# EAGLE design tanklight (EAGLE 6.4)
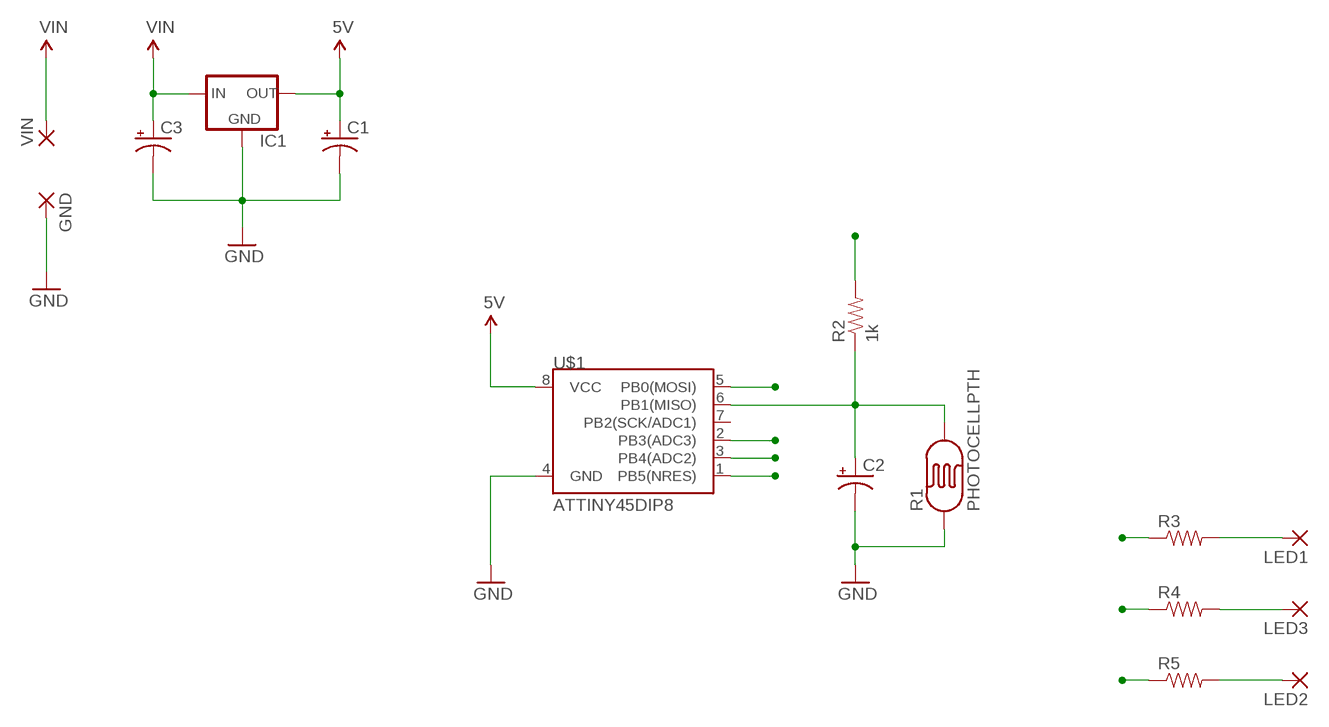
[diagram p0: schematic, sheet 1]

## Parts
C1  CAP_POLPTH2  [CPOL-RADIAL-10UF-25V]
C2  CAP_POLPTH1  [CPOL-RADIAL-100UF-25V]
C3  CAP_POLPTH2  [CPOL-RADIAL-10UF-25V]
GND  2,54/1,0  [2,54/1,0]
IC1  V_REG_78XXSINK  [TO220-IGO]
LED1  2,54/1,0  [2,54/1,0]
LED2  2,54/1,0  [2,54/1,0]
LED3  2,54/1,0  [2,54/1,0]
R1  PHOTOCELLPTH  [PHOTOCELL]
R2  1k  RESISTORPTH-1/4W  [AXIAL-0.4]
R3  RESISTORPTH-1/4W  [AXIAL-0.4]
R4  RESISTORPTH-1/4W  [AXIAL-0.4]
R5  RESISTORPTH-1/4W  [AXIAL-0.4]
U$1  ATTINY45DIP8  [DIP08]
VIN  2,54/1,0  [2,54/1,0]

## Nets
5V: C1.1(+) IC1.OUT R2.P$2 U$1.1(PB5(NRES)) U$1.8(VCC)
GND: C1.2(-) C2.2(-) C3.2(-) GND.1(P) IC1.GND R1.1 U$1.4(GND)
LED1: R3.P$1 U$1.5(PB0(MOSI))
LED2: R5.P$1 U$1.3(PB4(ADC2))
LED3: R4.P$1 U$1.2(PB3(ADC3))
N$1: C2.1(+) R1.2 R2.P$1 U$1.6(PB1(MISO))
N$2: LED1.1(P) R3.P$2
N$3: LED3.1(P) R4.P$2
N$4: LED2.1(P) R5.P$2
VIN: C3.1(+) IC1.IN VIN.1(P)
Unconnected: U$1.7(PB2(SCK/ADC1))

## Library data of the parts
C1-C3 = SparkFun-Passives:CAP_POL: Capacitor Polarized These are standard SMD and PTH capacitors. Normally 10uF, 47uF, and 100uF in electrolytic and tantalum varieties. Always verify the external diameter of the through hole cap, it varies with capacity, voltage, and manufacturer. The EIA devices should be standard.
GND LED1-LED3 VIN = wirepad:2,54/1,0: THROUGH-HOLE PAD
IC1 = SparkFun-PowerIC:V_REG_78XX: Voltage Regulator Standard 7805 5V regulator. IGO (Input Ground Output). Spark Fun Electronics SKU : COM-00107
R1 = SparkFun-Sensors:PHOTOCELL: CdS photoresistor. This is a low cost way to detect light levels. Resistance decreases with more incoming light. SparkFun SKU: SEN-09088
R2-R5 = SparkFun-Resistors:RESISTOR: Resistor Basic schematic elements and footprints for 0603, 1206, and PTH resistors.
U$1 = SparkFun-DigitalIC:ATTINY45: Atmel 8-pin 2/4/8kB flash uC

## Board
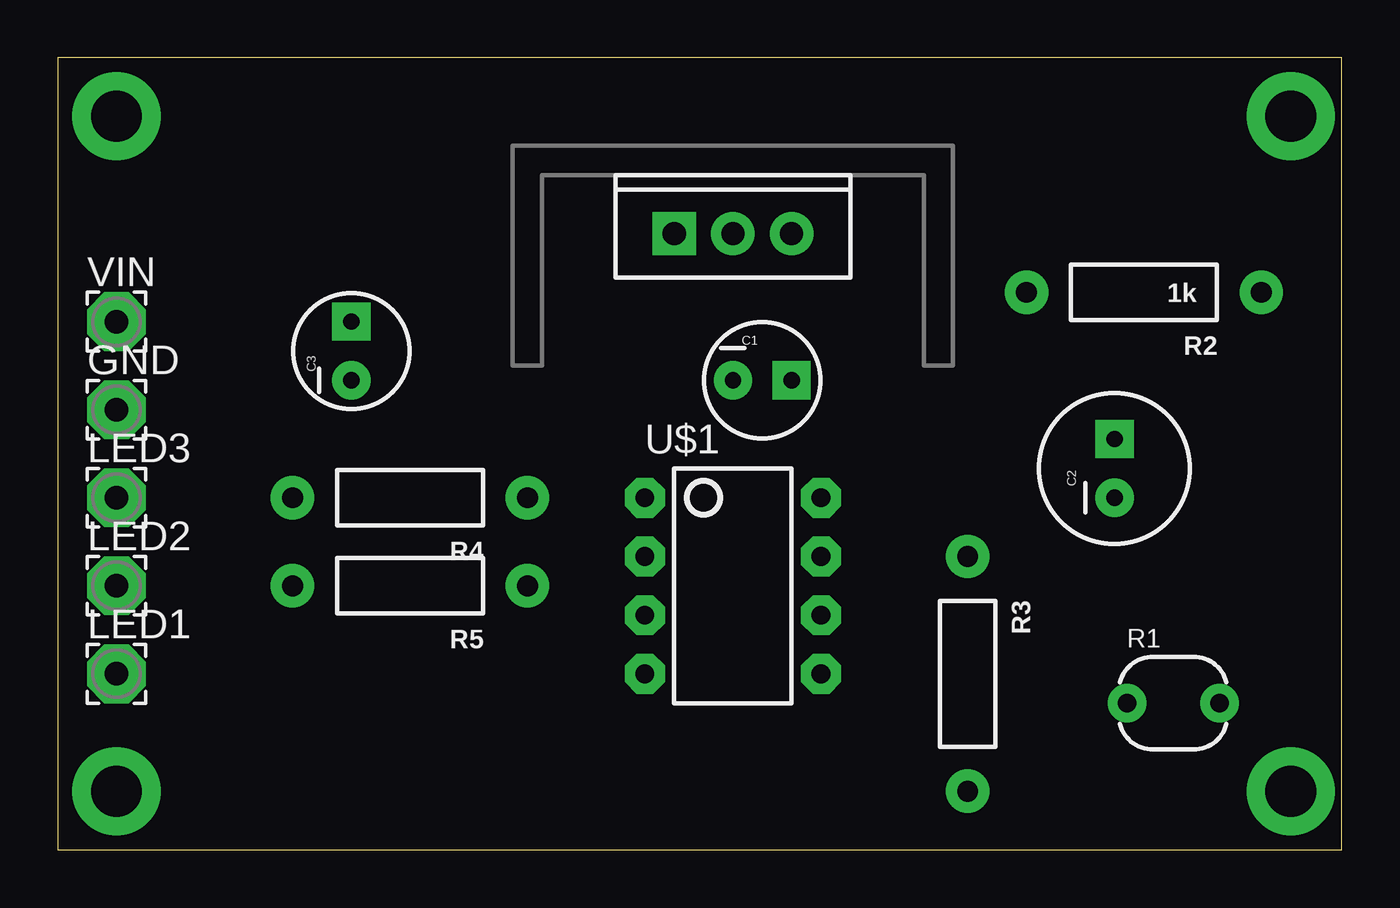
[diagram p1: board, top side]
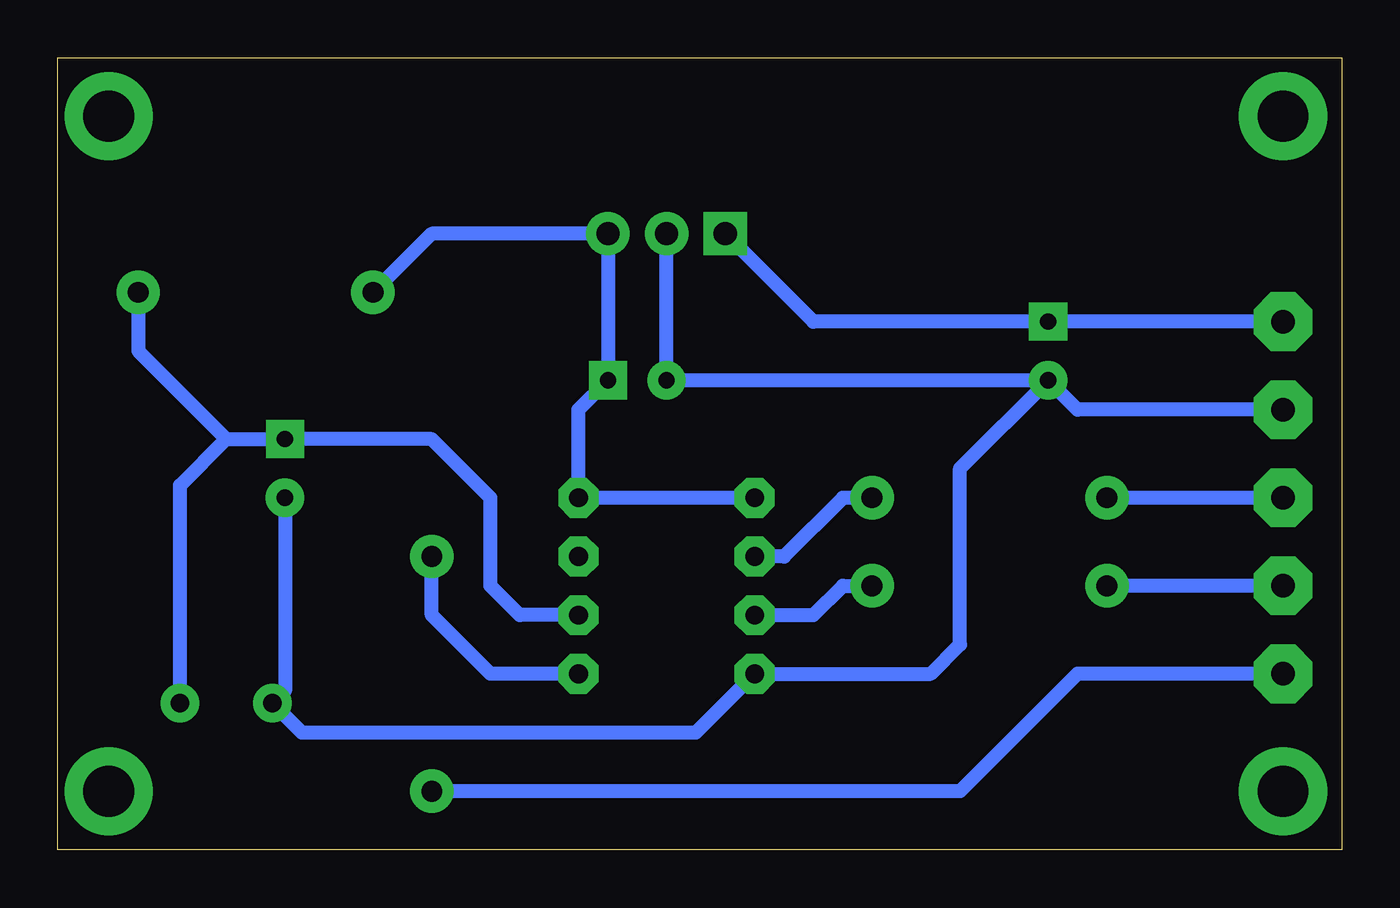
[diagram p2: board, bottom side, seen from below]

Size 55.55 x 34.28 mm. Coordinates in mm from the lower left corner, seen from the top.
Outline: 0,0 55.55,0 55.55,34.28 0,34.28 0,0
Copper layers (1*16): Top 0.035mm / dielectric 1.5mm / Bottom 0.035mm
Design rules "default": minimum track width 10mil, minimum drill 24mil, track to track 8mil, track to pad 8mil, pad to pad 8mil, via to via 8mil, smd to smd 8mil, copper to edge 40mil, drill to drill 8mil, minimum pad ring 10mil, minimum via ring 8mil, stop-mask expansion 4mil, vias tented up to drill 0mil, thermal gap 10mil

### Footprints (pad centres in the part's own frame; a part is rotated, then mirrored left to right if it is on the bottom)
CPOL-RADIAL-10UF-25V = drill 0.7 pad 1.651 square: 1 1.27,0 | drill 0.7 pad 1.651: 2 -1.27,0
CPOL-RADIAL-100UF-25V = drill 0.7 pad 1.651 square: 1 1.27,0 | drill 0.7 pad 1.651: 2 -1.27,0
2,54/1,0 = drill 1.016 pad 2.54 octagon: 1 0,0
TO220-IGO = drill 1 pad 1.88: GND 0,0; OUT 2.54,0 | drill 1 pad 1.88 square: IN -2.54,0
PHOTOCELL = drill 0.8 pad 1.676: 1 -2,0; 2 2,0
AXIAL-0.4 = drill 0.9 pad 1.88: P$1 -5.08,0; P$2 5.08,0
DIP08 = drill 0.813 pad 1.727 octagon: 1 -3.81,-3.81; 2 -1.27,-3.81; 3 1.27,-3.81; 4 3.81,-3.81; 5 3.81,3.81; 6 1.27,3.81; 7 -1.27,3.81; 8 -3.81,3.81

### Placement (x,y rotation side)
C1  30.48,20.32 0 top
C2  45.72,16.51 90 top
C3  12.7,21.59 90 top
GND  2.54,19.05 0 top
IC1  29.21,26.67 0 top
LED1  2.54,7.62 0 top
LED2  2.54,11.43 0 top
LED3  2.54,15.24 0 top
R1  48.26,6.35 0 top
R2  46.99,24.13 180 top
R3  39.37,7.62 270 top
R4  15.24,15.24 180 top
R5  15.24,11.43 180 top
U$1  29.21,11.43 270 top
VIN  2.54,22.86 0 top

### Tracks (layer width: path | path; a pad name or v marks a point on that pad's centre or on a via)
5V
  Bottom 0.61: R2.P$2 39.37,26.67 IC1.OUT C1.1 33.02,19.05 U$1.8 U$1.1
GND
  Bottom 0.61: GND.1 11.43,19.05 C3.2 | IC1.GND C1.2 C3.2 | C3.2 16.51,16.51 16.51,8.89 17.78,7.62 U$1.4 27.94,5.08 44.99,5.08 R1.1 45.72,6.89 C2.2
LED1
  Bottom 0.61: U$1.5 36.83,7.62 39.37,10.16 R3.P$1
LED2
  Bottom 0.61: U$1.3 22.86,10.16 21.59,11.43 R5.P$1
LED3
  Bottom 0.61: R4.P$1 21.59,15.24 24.13,12.7 U$1.2
N$1
  Bottom 0.61: U$1.6 35.56,10.16 36.83,11.43 36.83,15.24 39.37,17.78 C2.1 48.26,17.78 | R2.P$1 52.07,21.59 48.26,17.78 | R1.2 50.26,15.78 48.26,17.78
N$2
  Bottom 0.61: LED1.1 11.43,7.62 16.51,2.54 R3.P$2
N$3
  Bottom 0.61: LED3.1 R4.P$2
N$4
  Bottom 0.61: LED2.1 R5.P$2
N$5  (via drill 2.2 pad 3.81)
  other vias: 2.54,31.75
N$6  (via drill 2.2 pad 3.81)
  other vias: 2.54,2.54
N$7  (via drill 2.2 pad 3.81)
  other vias: 53.34,31.75
N$8  (via drill 2.2 pad 3.81)
  other vias: 53.34,2.54
VIN
  Bottom 0.61: VIN.1 C3.1 22.86,22.86 IC1.IN